# EAGLE design MEDIDOR_MTE (EAGLE 9.6.2)
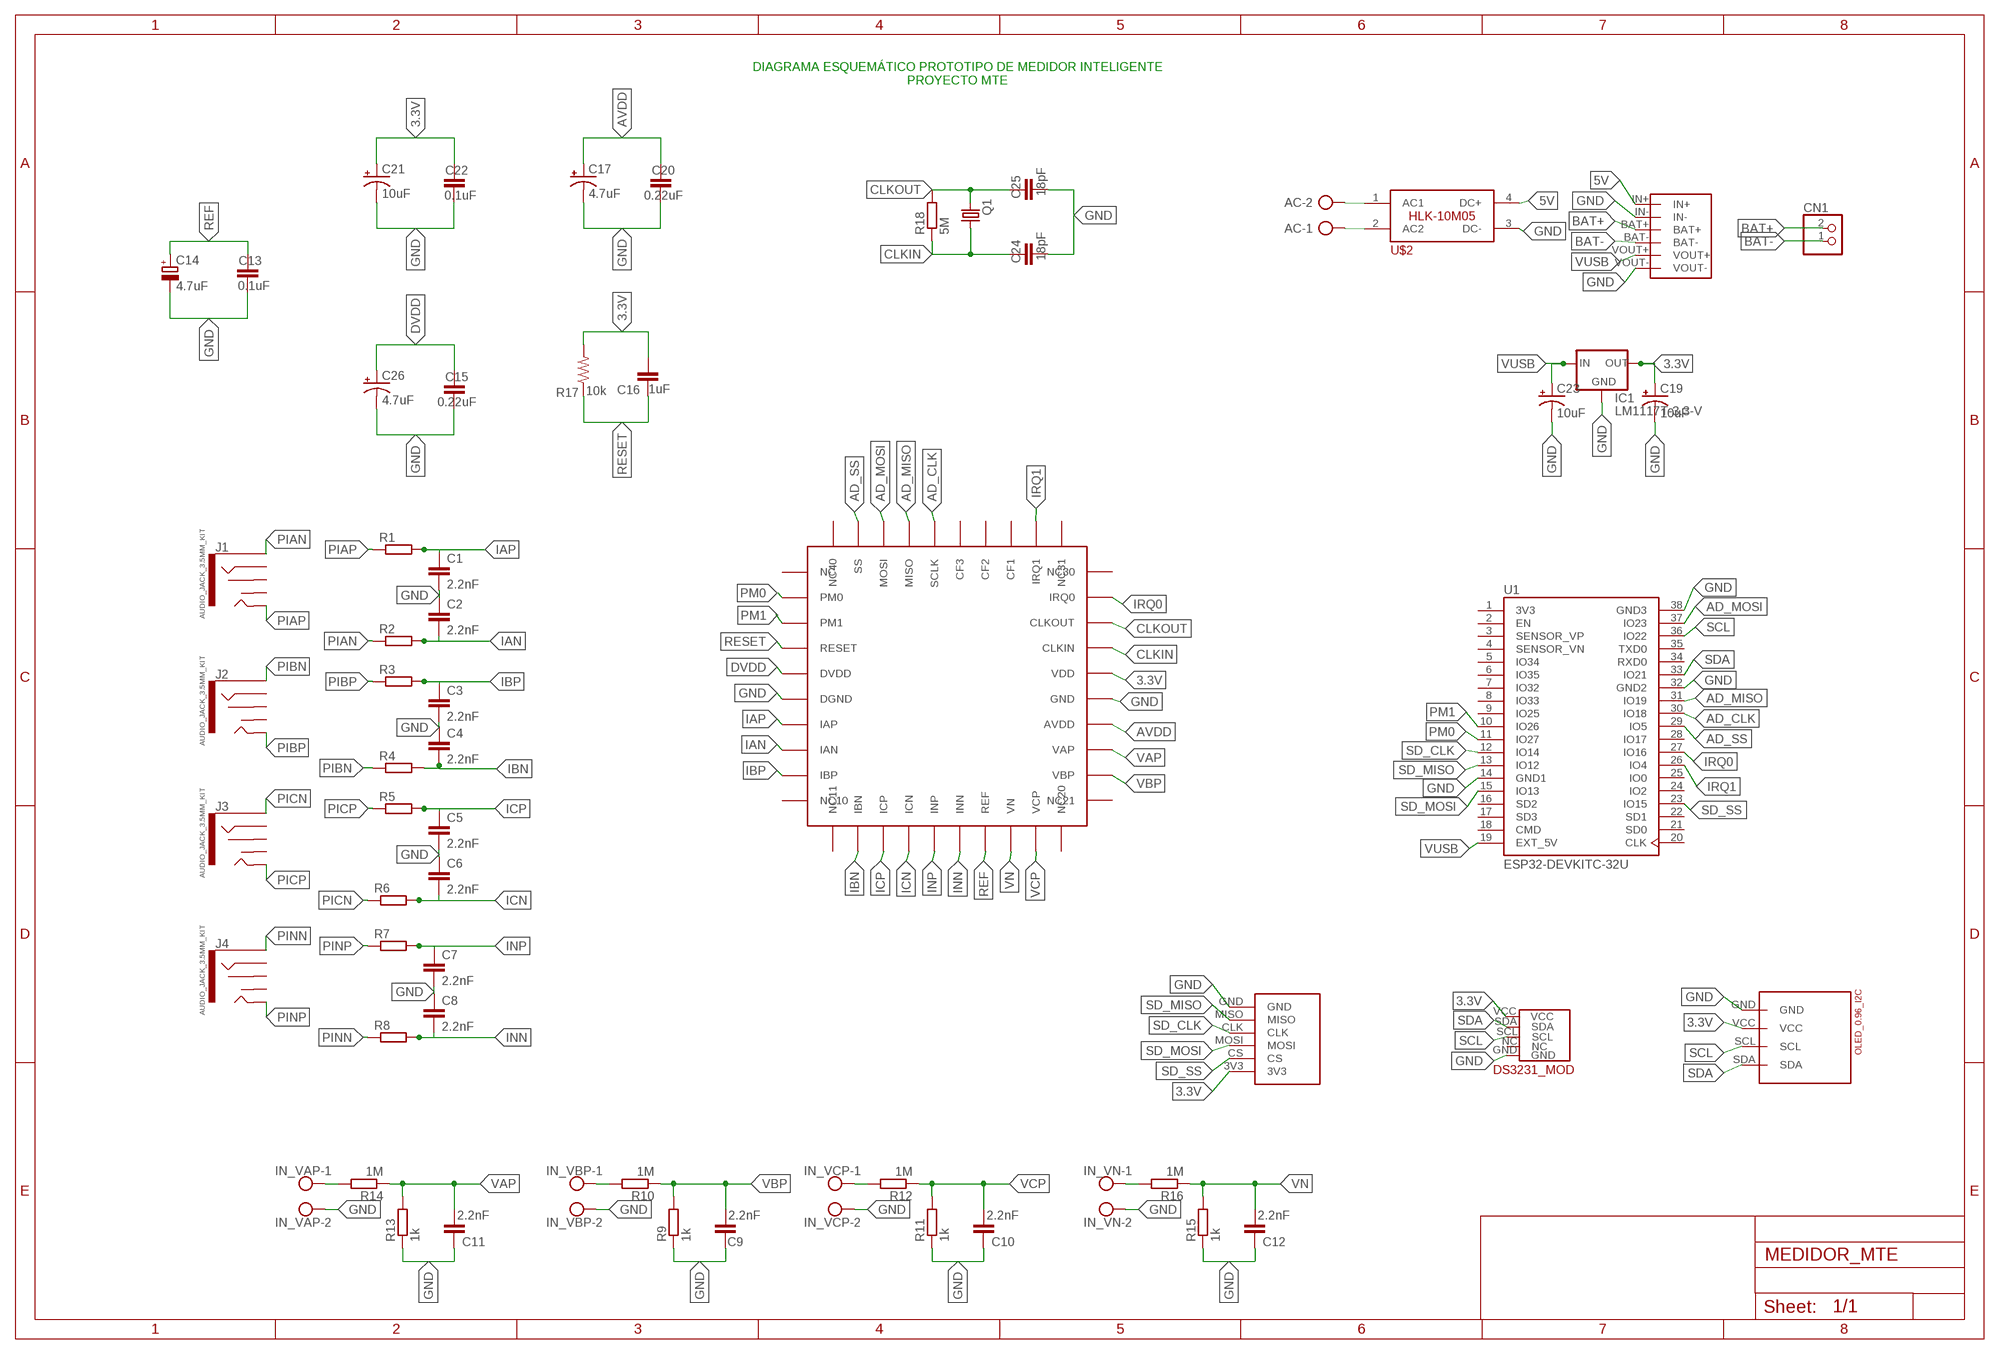
[diagram p0: schematic, sheet 1]

## Parts
AC  AK500/2  [AK500/2]
C1  2.2nF  C-EU025-025X050  [C025-025X050]
C2  2.2nF  C-EU025-025X050  [C025-025X050]
C3  2.2nF  C-EU025-025X050  [C025-025X050]
C4  2.2nF  C-EU025-025X050  [C025-025X050]
C5  2.2nF  C-EU025-025X050  [C025-025X050]
C6  2.2nF  C-EU025-025X050  [C025-025X050]
C7  2.2nF  C-EU025-025X050  [C025-025X050]
C8  2.2nF  C-EU025-025X050  [C025-025X050]
C9  2.2nF  C-EU025-025X050  [C025-025X050]
C10  2.2nF  C-EU025-025X050  [C025-025X050]
C11  2.2nF  C-EU025-025X050  [C025-025X050]
C12  2.2nF  C-EU025-025X050  [C025-025X050]
C13  0.1uF  C-EU025-025X050  [C025-025X050]
C14  4.7uF  CPOL-EUE3.5-8  [E3,5-8]
C15  0.22uF  C-EU025-025X050  [C025-025X050]
C16  1uF  C-EU025-025X050  [C025-025X050]
C17  4.7uF  CPOL-USE3.5-8  [E3,5-8]
C19  10uF  10UF-POLAR-RADIAL-2.5MM-25V-20%  [CPOL-RADIAL-2.5MM-5MM]
C20  0.22uF  C-EU025-025X050  [C025-025X050]
C21  10uF  CPOL-USE3.5-8  [E3,5-8]
C22  0.1uF  C-EU025-025X050  [C025-025X050]
C23  10uF  10UF-POLAR-RADIAL-2.5MM-25V-20%  [CPOL-RADIAL-2.5MM-5MM]
C24  18pF  C-EU025-025X050  [C025-025X050]
C25  18pF  C-EU025-025X050  [C025-025X050]
C26  4.7uF  CPOL-USE3.5-8  [E3,5-8]
CN1  JST_2PIN-THM  [JST-PH-2-THM]
IC1  LM1117T-3.3-V  [TO220V]
IN_VAP  AK500/2  [AK500/2]
IN_VBP  AK500/2  [AK500/2]
IN_VCP  AK500/2  [AK500/2]
IN_VN  AK500/2  [AK500/2]
J1  AUDIO_JACK_3.5MM_KIT  [AUDIO-JACK-KIT]
J2  AUDIO_JACK_3.5MM_KIT  [AUDIO-JACK-KIT]
J3  AUDIO_JACK_3.5MM_KIT  [AUDIO-JACK-KIT]
J4  AUDIO_JACK_3.5MM_KIT  [AUDIO-JACK-KIT]
Q1  CRYSTALHC49S  [HC49/S]
R1  R-EU_0207/12  [0207/12]
R2  R-EU_0207/12  [0207/12]
R3  R-EU_0207/12  [0207/12]
R4  R-EU_0207/12  [0207/12]
R5  R-EU_0207/12  [0207/12]
R6  R-EU_0207/12  [0207/12]
R7  R-EU_0207/12  [0207/12]
R8  R-EU_0207/12  [0207/12]
R9  1k  R-EU_0207/12  [0207/12]
R10  1M  R-EU_0207/12  [0207/12]
R11  1k  R-EU_0207/12  [0207/12]
R12  1M  R-EU_0207/12  [0207/12]
R13  1k  R-EU_0207/12  [0207/12]
R14  1M  R-EU_0207/12  [0207/12]
R15  1k  R-EU_0207/12  [0207/12]
R16  1M  R-EU_0207/12  [0207/12]
R17  10k  R-US_0207/12  [0207/12]
R18  5M  R-EU_0207/12  [0207/12]
U1  ESP32-DEVKITC-32U  [MODULE_ESP32-DEVKITC-32U]
U2  ADE7880  [ADE7880_HDER]
U$2  HLK-10M05  [HLK-10M05]
U$3  J5019_UPS  [J5019_UPS]
U$4  OLED_I2C_096  [OLED_096_I2C]
U$5  MODULO_MSD2  [MICROSD-BREAKOUT]
U$6  DS3231_MOD  [DS3231_MOD]

## Nets
3.3V: C16.2 C19.1(+) C21.+ C22.2 IC1.2(OUT) R17.2 U2.PIN26(VDD) U$4.VCC U$5.3V3 U$6.VCC
5V: U$2.4(DC+) U$3.IN+
AD_CLK: U1.30(IO18) U2.PIN36(SCLK)
AD_MISO: U1.31(IO19) U2.PIN37(MISO)
AD_MOSI: U1.37(IO23) U2.PIN38(MOSI)
AD_SS: U1.29(IO5) U2.PIN39(SS)
AVDD: C17.+ C20.2 U2.PIN24(AVDD)
BAT+: CN1.2 U$3.BAT+
BAT-: CN1.1 U$3.BAT-
CLKIN: C24.2 Q1.1 R18.1 U2.PIN27(CLKIN)
CLKOUT: C25.2 Q1.2 R18.2 U2.PIN28(CLKOUT)
DVDD: C15.2 C26.+ U2.PIN5(DVDD)
GND: C1.2 C2.1 C3.2 C4.1 C5.2 C6.1 C7.2 C8.1 C9.1 C10.1 C11.1 C12.1 C13.1 C14.- C15.1 C17.- C19.2(-) C20.1 C21.- C22.1 C23.2(-) C24.1 C25.1 C26.- IC1.1(GND) IN_VAP.2 IN_VBP.2 IN_VCP.2 IN_VN.2 R9.1 R11.1 R13.1 R15.1 U1.14(GND1) U1.32(GND2) U1.38(GND3) U2.PIN6(DGND) U2.PIN25(GND) U$2.3(DC-) U$3.IN- U$3.VOUT- U$4.GND U$5.GND U$6.GND
IAN: C2.2 R2.2 U2.PIN8(IAN)
IAP: C1.1 R1.2 U2.PIN7(IAP)
IBN: C4.2 R4.2 U2.PIN12(IBN)
IBP: C3.1 R3.2 U2.PIN9(IBP)
ICN: C6.2 R6.2 U2.PIN14(ICN)
ICP: C5.1 R5.2 U2.PIN13(ICP)
INN: C8.2 R8.2 U2.PIN16(INN)
INP: C7.1 R7.2 U2.PIN15(INP)
IRQ0: U1.27(IO16) U2.PIN29(IRQ0)
IRQ1: U1.26(IO4) U2.PIN32(IRQ1)
N$2: IN_VBP.1 R10.2
N$3: IN_VCP.1 R12.2
N$4: IN_VAP.1 R14.2
N$5: IN_VN.1 R16.2
N$6: AC.2 U$2.1(AC1)
N$7: AC.1 U$2.2(AC2)
PIAN: J1.SLEEVE R2.1
PIAP: J1.TIP R1.1
PIBN: J2.SLEEVE R4.1
PIBP: J2.TIP R3.1
PICN: J3.SLEEVE R6.1
PICP: J3.TIP R5.1
PINN: J4.SLEEVE R8.1
PINP: J4.TIP R7.1
PM0: U1.11(IO27) U2.PIN2(PM0)
PM1: U1.10(IO26) U2.PIN3(PM1)
REF: C13.2 C14.+ U2.PIN17(REF)
RESET: C16.1 R17.1 U2.PIN4(RESET)
SCL: U1.36(IO22) U$4.SCL U$6.SCL
SD_CLK: U1.12(IO14) U$5.CLK
SD_MISO: U1.13(IO12) U$5.MISO
SD_MOSI: U1.15(IO13) U$5.MOSI
SD_SS: U1.23(IO15) U$5.CS
SDA: U1.33(IO21) U$4.SDA U$6.SDA
VAP: C11.2 R13.2 R14.1 U2.PIN23(VAP)
VBP: C9.2 R9.2 R10.1 U2.PIN22(VBP)
VCP: C10.2 R11.2 R12.1 U2.PIN19(VCP)
VN: C12.2 R15.2 R16.1 U2.PIN18(VN)
VUSB: C23.1(+) IC1.3(IN) U1.19(EXT_5V) U$3.VOUT+
Unconnected: J1.RING J1.RSH J1.TSH J2.RING J2.RSH J2.TSH J3.RING J3.RSH J3.TSH J4.RING J4.RSH J4.TSH U1.2(EN) U1.3(SENSOR_VP) U1.4(SENSOR_VN) U1.5(IO34) U1.6(IO35) U1.7(IO32) U1.8(IO33) U1.9(IO25) U1.16(SD2) U1.17(SD3) U1.18(CMD) U1.20(CLK) U1.21(SD0) U1.22(SD1) U1.24(IO2) U1.25(IO0) U1.28(IO17) U1.34(RXD0) U1.35(TXD0) U2.PIN1(NC) U2.PIN10(NC10) U2.PIN11(NC11) U2.PIN20(NC20) U2.PIN21(NC21) U2.PIN30(NC30) U2.PIN31(NC31) U2.PIN33(CF1) U2.PIN34(CF2) U2.PIN35(CF3) U2.PIN40(NC40) U$6.NC

## Notes on the sheet
- DIAGRAMA ESQUEMÁTICO PROTOTIPO DE MEDIDOR INTELIGENTE
  PROYECTO MTE

## Power pins joined to a net without a drawn wire
3V3: U1.1(3V3)

## Library data of the parts
AC IN_VAP IN_VBP IN_VCP IN_VN = con-ptr500_v2:AK500/2: CONNECTOR; OC_FARNELL: unknown; OC_NEWARK: unknown
C1-C13 C15 C16 C20 C22 C24 C25 = rcl:C-EU: CAPACITOR, European symbol; SPICEPREFIX: C
C14 = rcl:CPOL-EU: POLARIZED CAPACITOR, European symbol; SPICEPREFIX: C
C17 C21 C26 = rcl:CPOL-US: POLARIZED CAPACITOR, American symbol; SPICEPREFIX: C
C19 C23 = SparkFun-Capacitors:10UF-POLAR: 10.0µF polarized capacitors A capacitor is a passive two-terminal electrical component used to store electrical energy temporarily in an electric field.; PROD_ID: CAP-08440
CN1 = adafruit:JST_2PIN: JST 2-Pin Connectors of various flavors SMT-RA (S2B-PH-SM4) 4UConnector #17311 SMT (B2B-PH-SM4) THM-RA (S2B-PH) THM (B2B-PH)
IC1 = lm1117:LM1117T-*
J1-J4 = SparkFun-Connectors:AUDIO_JACK_3.5MM: Audio Jack 3.5mm variants of PTH and SMT stereo audio jack with bypass switches. SparkFun Products: SparkFun SparkPunk Sound Kit <[https://www.sparkfun.com/products/11177]> - PTH MP3 Trigger <https://www.sparkfun.com/products/13720> -3.5mm SMD SparkFun PicoBoard <https://www.sparkfun.com/products/11888>- 2.5mm SMD; PROD_ID: CONN-08774; SF_ID: PRT-08032
Q1 = crystal_v2:CRYSTAL: CRYSTAL; OC_FARNELL: 1667008; OC_NEWARK: unknown
R1-R8 = rcl:R-EU_: RESISTOR, European symbol; SPICEPREFIX: R
R9-R16 R18 = rcl_v2:R-EU_: RESISTOR, European symbol; SPICEPREFIX: R
R17 = rcl:R-US_: RESISTOR, American symbol; SPICEPREFIX: R
U1 = ESP32-DEVKITC-32U:ESP32-DEVKITC-32U: ESP32-DEVKITC Check availability <https://pricing.snapeda.com/parts/ESP32-DEVKITC-32U/Espressif%20Systems/view-part?ref=eda>; AVAILABILITY: In Stock; CHECK_PRICES: https://www.snapeda.com/parts/ESP32-DEVKITC-32U/Espressif+Systems/view-part/?ref=eda; DESCRIPTION: ESP32-WROOM-32UE series Transceiver; 802.11 b/g/n (Wi-Fi, WiFi, WLAN), Bluetooth® Smart Ready 4.x Dual Mode Evaluation Board; MF: Espressif Systems; MP: ESP32-DEVKITC-32U; PACKAGE: CUSTOM-38 ESPRESSIF; PRICE: None; PURCHASE-URL: https://www.snapeda.com/api/url_track_click_mouser/?unipart_id=2781909&manufacturer=Espressif Systems&part_name=ESP32-DEVKITC-32U&search_term=None; SNAPEDA_LINK: https://www.snapeda.com/parts/ESP32-DEVKITC-32U/Espressif+Systems/view-part/?ref=snap
U2 = ADE7881_HDER:ADE7880
U$2 = HLK-10M05_V2:HLK-10M05; AVAILABILITY: Unavailable; MF: Hi-link; MP: hlk-pm01; PACKAGE: Package Analog Devices; PRICE: None
U$3 = POWER_SOURCES:J5019_UPS
U$4 = OLED_I2C:OLED_I2C_096
U$5 = MSD2:MODULO_MSD2
U$6 = DS3231_,MOD:DS3231_MOD

## Board
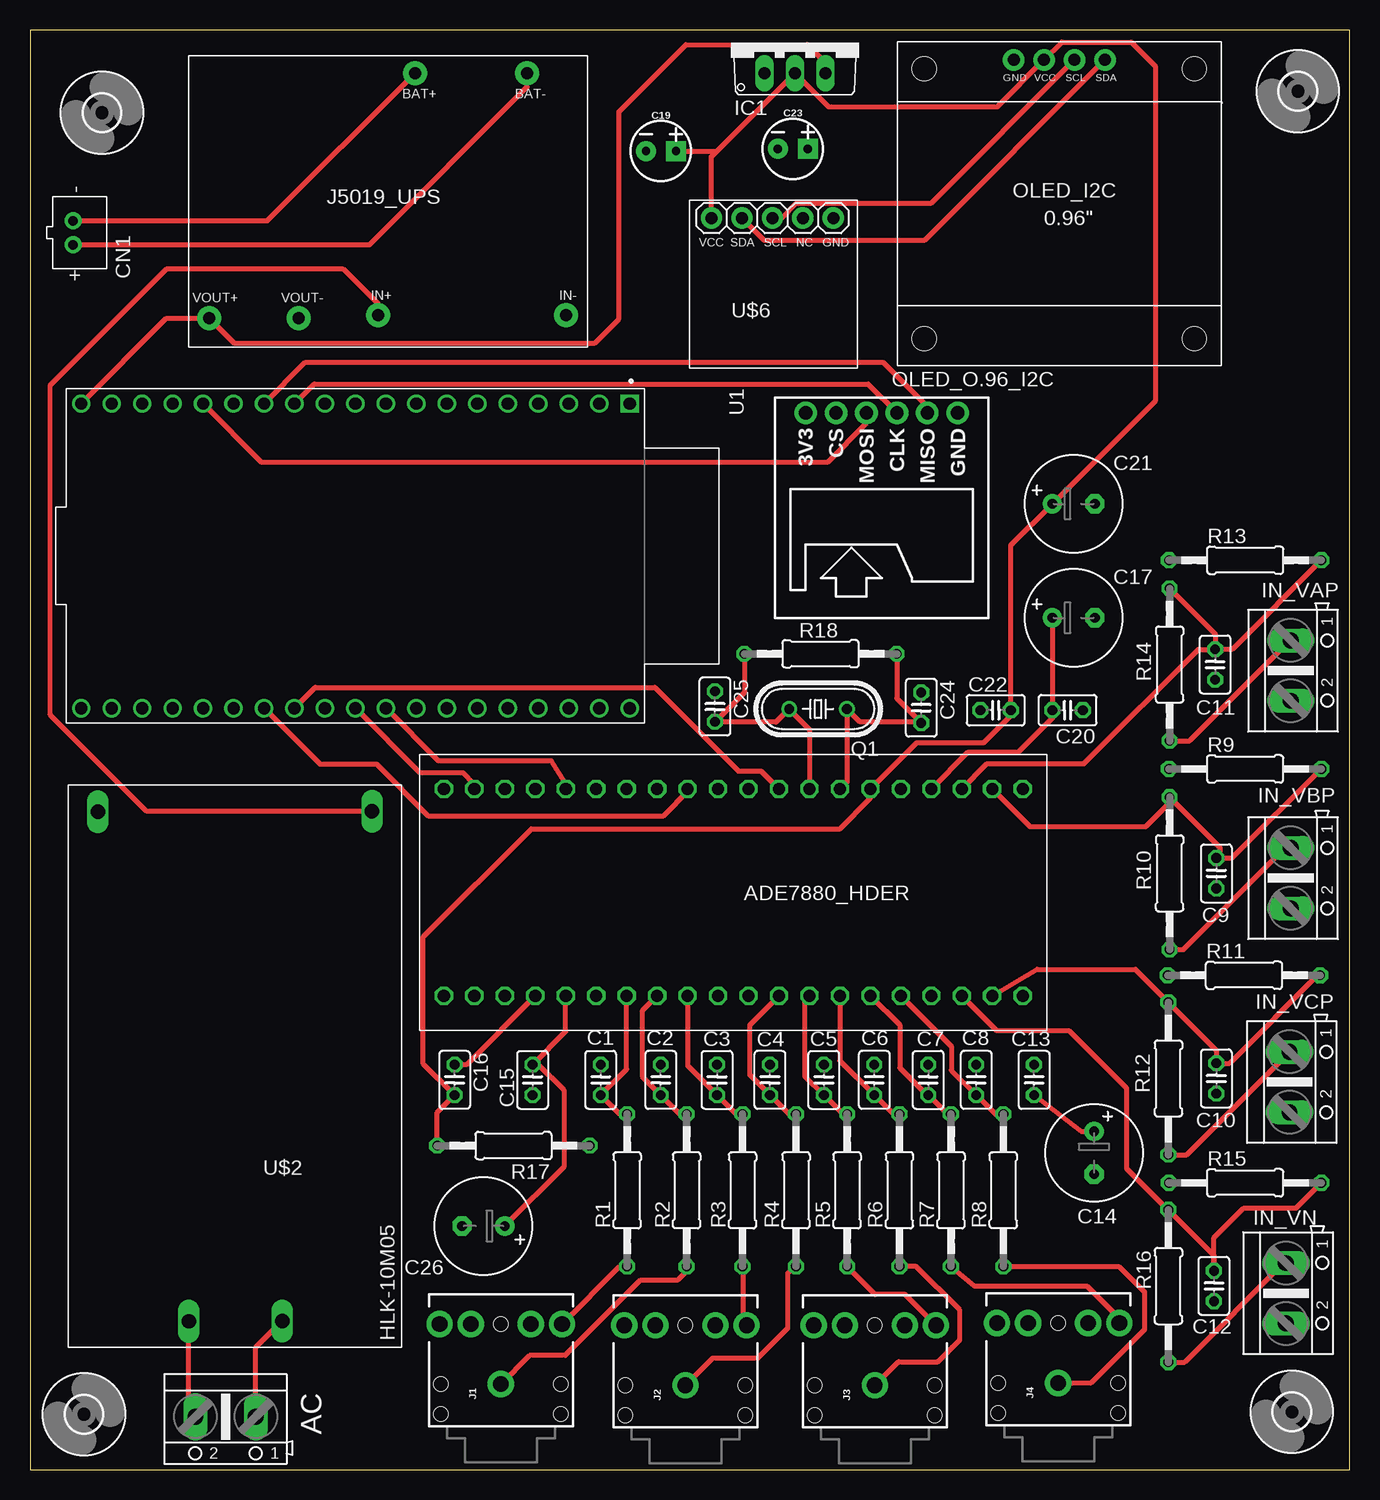
[diagram p1: board, top side]
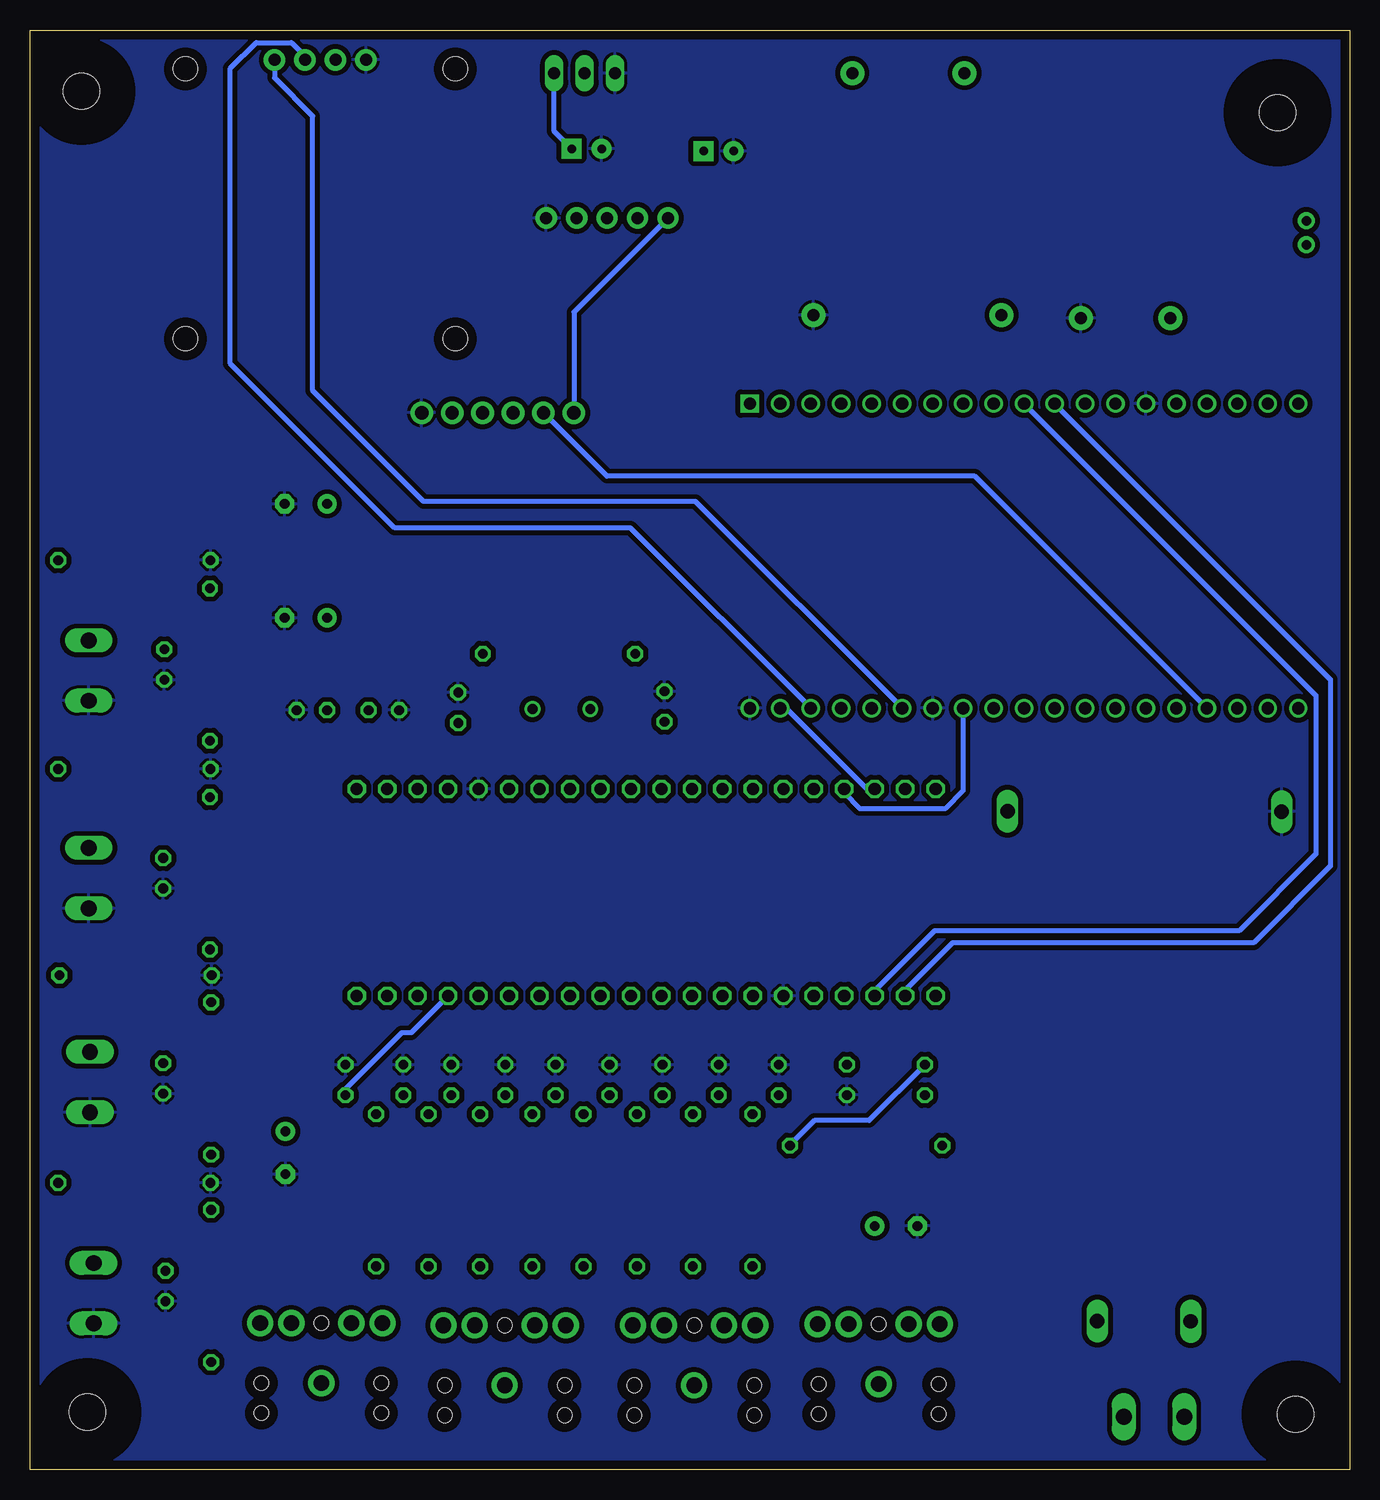
[diagram p2: board, bottom side, seen from below]

Size 110 x 120 mm. Coordinates in mm from the lower left corner, seen from the top.
Outline: 0,0 110,0 110,120 0,120 0,0
Copper layers (1*16): Top 0.035mm / dielectric 1.5mm / Bottom 0.035mm
Design rules "default *": minimum track width 6mil, minimum drill 0.35mm, track to track 6mil, track to pad 6mil, pad to pad 6mil, via to via 6mil, smd to smd 6mil, copper to edge 30mil, drill to drill 6mil, minimum pad ring 10mil, minimum via ring 8mil, stop-mask expansion 4mil, vias tented up to drill 0mil, thermal gap 10mil

### Footprints (pad centres in the part's own frame; a part is rotated, then mirrored left to right if it is on the bottom)
AK500/2 = drill 1.321 long: 1 -2.515,0; 2 2.515,0
C025-025X050 = drill 0.813 octagon: 1 -1.27,0; 2 1.27,0
E3,5-8 = drill 0.813 pad 1.6: + -1.778,0 | drill 0.813 pad 1.6 octagon: - 1.778,0
CPOL-RADIAL-2.5MM-5MM = drill 0.7 pad 1.651 square: 1 1.25,0 | drill 0.7 pad 1.651: 2 -1.25,0
JST-PH-2-THM = drill 0.8 pad 1.422: 1 1,0; 2 -1,0
TO220V = drill 1.016 long: 1 -2.54,-2.54; 2 0,-2.54; 3 2.54,-2.54
AUDIO-JACK-KIT = drill 1.3 pad 2.184: RING 5,5.1; RSH 5,2.5; SLEEVE 0,0; TIP 5,-5.1; TSH 5,-2.5 | hole 1.2: 0,5; -2.5,5; -2.5,-5; 0,-5; 5,0
HC49/S = drill 0.813: 1 -2.413,0; 2 2.413,0
0207/12 = drill 0.813 octagon: 1 -6.35,0; 2 6.35,0
MODULE_ESP32-DEVKITC-32U = drill 1.02 square: 1 -12.7,22.85 | drill 1.02: 2 -12.7,20.31; 3 -12.7,17.77; 4 -12.7,15.23; 5 -12.7,12.69; 6 -12.7,10.15; 7 -12.7,7.61; 8 -12.7,5.07; 9 -12.7,2.53; 10 -12.7,-0.01; 11 -12.7,-2.55; 12 -12.7,-5.09; 13 -12.7,-7.63; 14 -12.7,-10.17; 15 -12.7,-12.71; 16 -12.7,-15.25; 17 -12.7,-17.79; 18 -12.7,-20.33; 19 -12.7,-22.87; 20 12.7,-22.87; 21 12.7,-20.33; 22 12.7,-17.79; 23 12.7,-15.25; 24 12.7,-12.71; 25 12.7,-10.17; 26 12.7,-7.63; 27 12.7,-5.09; 28 12.7,-2.55; 29 12.7,-0.01; 30 12.7,2.53; 31 12.7,5.07; 32 12.7,7.61; 33 12.7,10.15; 34 12.7,12.69; 35 12.7,15.23; 36 12.7,17.77; 37 12.7,20.31; 38 12.7,22.85
ADE7880_HDER = drill 1.016 octagon: PIN1 -8.624,24.13; PIN2 -8.624,21.59; PIN3 -8.624,19.05; PIN4 -8.624,16.51; PIN5 -8.624,13.97; PIN6 -8.624,11.43; PIN7 -8.624,8.89; PIN8 -8.624,6.35; PIN9 -8.624,3.81; PIN10 -8.624,1.27; PIN11 -8.624,-1.27; PIN12 -8.624,-3.81; PIN13 -8.624,-6.35; PIN14 -8.624,-8.89; PIN15 -8.624,-11.43; PIN16 -8.624,-13.97; PIN17 -8.624,-16.51; PIN18 -8.624,-19.05; PIN19 -8.624,-21.59; PIN20 -8.624,-24.13; PIN21 8.624,-24.13; PIN22 8.624,-21.59; PIN23 8.624,-19.05; PIN24 8.624,-16.51; PIN25 8.624,-13.97; PIN26 8.624,-11.43; PIN27 8.624,-8.89; PIN28 8.624,-6.35; PIN29 8.624,-3.81; PIN30 8.624,-1.27; PIN31 8.624,1.27; PIN32 8.624,3.81; PIN33 8.624,6.35; PIN34 8.624,8.89; PIN35 8.624,11.43; PIN36 8.624,13.97; PIN37 8.624,16.51; PIN38 8.624,19.05; PIN39 8.624,21.59; PIN40 8.624,24.13
HLK-10M05 = drill 1.2 long: 1 -14.827,7.745; 2 -14.789,-0.049; 3 27.667,15.32; 4 27.679,-7.535
J5019_UPS = drill 1 pad 2: BAT+ 18.855,22.829; BAT- 28.22,22.829; IN+ 15.777,2.666; IN- 31.454,2.666; VOUT+ 1.718,2.385; VOUT- 9.169,2.385
OLED_096_I2C = drill 1 pad 1.778: GND -3.8,12; SCL 1.28,12; SDA 3.82,12; VCC -1.26,12 | hole 2: -11.25,11.25; -11.25,-11.25; 11.25,-11.25; 11.25,11.25
MICROSD-BREAKOUT = drill 1.118 pad 1.88: 3V3 -5.89,8.7; CLK 1.73,8.7; CS -3.35,8.7; GND 6.81,8.7; MISO 4.27,8.7; MOSI -0.81,8.7
DS3231_MOD = drill 1 pad 1.778: GND 5.01,5.51; NC 2.47,5.51; SCL -0.07,5.51; SDA -2.61,5.51; VCC -5.15,5.51
3,0 = hole 3: 0,0

### Placement (x,y rotation side)
AC  16.3,4.4 180 top
C1  47.58,32.48 90 top
C2  52.58,32.48 270 top
C3  57.28,32.48 90 top
C4  61.68,32.48 270 top
C5  66.18,32.48 90 top
C6  70.38,32.48 270 top
C7  74.88,32.48 90 top
C8  78.88,32.48 270 top
C9  98.9,49.7 90 top
C10  98.9,32.6 90 top
C11  98.8,67.1 90 top
C12  98.7,15.3 90 top
C13  83.7,32.48 270 top
C14  88.7,26.4 270 top
C15  41.9,32.48 90 top
C16  35.4,32.48 270 top
C17  87,71 0 top
C19  52.6,109.9 0 top
C20  86.5,63.3 180 top
C21  87,80.5 0 top
C22  80.5,63.3 0 top
C23  63.6,110.1 0 top
C24  74.3,63.5 270 top
C25  57.1,63.6 270 top
C26  37.8,20.3 180 top
CN1  3.6,103.1 270 top
IC1  63.77,118.94 0 top
IN_VAP  105.1,66.6 270 top
IN_VBP  105.1,49.3 270 top
IN_VCP  105,32.3 270 top
IN_VN  104.7,14.7 270 top
J1  39.25,7.12 90 top
J2  54.64,7.02 90 top
J3  70.43,7.02 90 top
J4  85.71,7.2 90 top
Q1  65.7,63.4 180 top
R1  49.78,23.28 90 top
R2  54.74,23.28 90 top
R3  59.4,23.28 90 top
R4  63.86,23.28 90 top
R5  68.12,23.28 90 top
R6  72.48,23.28 90 top
R7  76.78,23.28 90 top
R8  81.14,23.28 90 top
R9  101.3,58.4 0 top
R10  95,49.7 270 top
R11  101.2,41.2 0 top
R12  94.9,32.6 270 top
R13  101.3,75.8 0 top
R14  95,67.1 270 top
R15  101.3,23.9 0 top
R16  94.9,15.3 270 top
R17  40.3,27 180 top
R18  65.9,68 180 top
U1  27.14,76.16 270 top
U2  58.63,48.11 90 top
U$2  20.98,27.18 90 top
U$3  13.23,93.58 0 top
U$4  85.8,105.51 0 top
U$5  70.54,79.39 0 top
U$6  61.96,98.82 0 top
U$7  [3,0]  105.2,4.8 0 top
U$8  [3,0]  4.5,4.6 0 top
U$9  [3,0]  105.7,114.9 0 top
U$10  [3,0]  6,113.1 0 top

### Tracks (layer width: path | path; a pad name or v marks a point on that pad's centre or on a via)
3.3V
  Top 0.406: U$6.VCC 56.81,109.44 57.27,109.9 | R17.2 33.95,29.76 C16.2 32.78,33.83 32.78,44.38 41.8,53.4 67.5,53.4 70.06,55.96 U2.PIN26 73.93,60.6 79.5,60.6 81.77,62.87 C22.2 81.77,77.05 C21.+ 93.8,89.08 93.8,116.98 91.8,118.98 86.01,118.98 U$4.VCC 80.63,113.6 66.57,113.6 IC1.2 57.53,110.17 57.27,109.9 | C19.1 57.27,109.9
  Bottom 0.406: U$6.VCC 64.65,96.49 U$5.3V3
5V
  Top 0.406: U$2.4 9.74,54.86 1.7,62.9 1.7,90.4 11.4,100.1 26.1,100.1 29.01,97.19 U$3.IN+
AD_CLK
  Top 0.406: U1.30 34.03,59.1 43.45,59.1 44.66,57.2 U2.PIN36
AD_MISO
  Bottom 0.406: U1.31 32.21,56.59 33.7,55.1 40.84,55.1 42.12,56.38 U2.PIN37
AD_MOSI
  Bottom 0.406: U1.37 46.96,63.46 40.23,56.73 U2.PIN38
AD_SS
  Top 0.406: U1.29 32.49,58.1 36.1,58.1 37.04,57.16 U2.PIN39
AVDD
  Top 0.406: C17.+ C20.2 85.23,62.63 82.4,59.8 78.21,59.8 U2.PIN24
BAT+
  Top 0.406: CN1.2 19.78,104.1 U$3.BAT+
BAT-
  Top 0.406: CN1.1 28.3,102.1 41.45,115.25 U$3.BAT-
CLKIN
  Top 0.406: U2.PIN27 68.11,57.33 Q1.1 69.15,62.37 74.44,62.37 C24.2 72.25,64.28 R18.1
CLKOUT
  Top 0.406: U2.PIN28 64.98,61.71 Q1.2 62.19,62.3 57.13,62.3 C25.2 59.55,64.78 R18.2
DVDD
  Top 0.406: C26.+ 44.52,25.24 44.52,31.63 42.4,33.75 C15.2 44.66,36.51 U2.PIN5
GND
  pour Bottom (isolate 0.406): 0,0 0,120 110,120 110,0
IAN
  Top 0.406: U2.PIN8 51.06,38.27 51.06,32.73 C2.2 54.16,29.63 R2.2
IAP
  Top 0.406: R1.2 49.16,29.63 C1.1 49.74,33.37 U2.PIN7
IBN
  Top 0.406: U2.PIN12 60,37.05 60,32.89 C4.2 63.26,29.63 R4.2
IBP
  Top 0.406: U2.PIN9 54.82,33.67 C3.1 58.86,29.63 R3.2
ICN
  Top 0.406: U2.PIN14 67.52,34.07 C6.2 71.96,29.63 R6.2
ICP
  Top 0.406: U2.PIN13 64.58,39.09 64.58,32.81 C5.1 67.76,29.63 R5.2
INN
  Top 0.406: U2.PIN16 76.8,35.29 76.8,33.29 C8.2 80.46,29.63 R8.2
INP
  Top 0.406: U2.PIN15 72.5,37.05 72.5,33.5 74.79,31.21 C7.1 76.46,29.63 R7.2
IRQ0
  Top 0.406: U1.27 23.79,65.2 52.1,65.2 59.1,58.2 60.97,58.2 U2.PIN29
IRQ1
  Top 0.406: U1.26 24.17,58.8 28.9,58.8 33.2,54.5 52.8,54.5 54.94,56.64 U2.PIN32
N$2
  Top 0.406: R10.2 96.16,43.35 104.62,51.81 IN_VBP.1
N$3
  Top 0.406: R12.2 96.44,26.25 IN_VCP.1
N$4
  Top 0.406: R14.2 96.66,60.75 105.02,69.11 IN_VAP.1
N$5
  Top 0.406: IN_VN.1 104.52,17.21 96.26,8.95 R16.2
N$6
  Top 0.406: AC.2 13.23,4.95 U$2.1
N$7
  Top 0.406: AC.1 18.82,10.18 U$2.2
PIAN
  Top 0.406: J1.SLEEVE 41.65,9.52 44.62,9.52 50.9,15.8 54,15.8 54.74,16.54 R2.1
PIAP
  Top 0.406: J1.TIP 49.16,16.93 R1.1
PIBN
  Top 0.406: J2.SLEEVE 56.92,9.3 60.7,9.3 63.16,11.76 63.16,16.37 63.49,16.56 R4.1
PIBP
  Top 0.406: J2.TIP 59.44,12.32 59.44,16.94 R3.1
PICN
  Top 0.406: J3.SLEEVE 72.41,9 75.7,9 77.5,10.8 77.5,13.3 73.87,16.93 R6.1
PICP
  Top 0.406: J3.TIP 72.95,14.6 70.45,14.6 R5.1
PINN
  Top 0.406: J4.SLEEVE 88.44,7.2 92.9,11.66 92.9,14.8 90.77,16.93 R8.1
PINP
  Top 0.406: R7.1 78.73,15.3 88.1,15.3 90.81,12.59 J4.TIP
PM0
  Bottom 0.406: U1.11 1.6,65.87 1.6,50.3 8,43.9 33.1,43.9 37.04,39.96 U2.PIN2
PM1
  Bottom 0.406: U1.10 2.8,64.53 2.8,51.3 9.2,44.9 34.6,44.9 39.58,39.92 U2.PIN3
REF
  Top 0.406: C13.2 87.65,28.18 C14.+
  Bottom 0.406: U2.PIN17 78.23,36.4 79.01,36.4 83.7,31.71 C13.2
RESET
  Top 0.406: U2.PIN4 36.38,33.75 C16.1
  Bottom 0.406: C16.1 40.05,29.1 44.6,29.1 46.65,27.05 R17.1
SCL
  Top 0.406: U$6.SCL 62.67,104.33 63.91,105.58 75.14,105.58 U$4.SCL
  Bottom 0.406: U1.36 59.95,78.5 79.6,78.5 93.3,92.2 93.3,116.8 91.14,118.95 88.2,118.95 87.08,117.83 U$4.SCL
SD_CLK
  Top 0.406: U1.12 23.69,90.5 69.86,90.5 U$5.CLK
SD_MISO
  Top 0.406: U1.13 22.95,92.3 71.1,92.3 74.81,88.59 U$5.MISO
SD_MOSI
  Top 0.406: U1.15 19.29,84 66.5,84 69.73,87.23 U$5.MOSI
SD_SS
  Bottom 0.406: U1.23 31.23,82.8 61.9,82.8 U$5.CS
SDA
  Top 0.406: U$6.SDA 59.35,104.31 61.17,102.48 74.59,102.48 U$4.SDA
  Bottom 0.406: U1.33 54.53,80.7 77.2,80.7 86.44,89.94 86.44,112.83 89.62,116.01 U$4.SDA
VAP
  Top 0.406: R14.1 98.8,69.65 C11.2 | R13.2 100.22,68.37 C11.2 | C11.2 97.4,68.37 87.86,58.84 79.78,58.84 U2.PIN23
VBP
  Top 0.406: C9.2 99.2,50.97 | 99.2,50.97 100.2,50.97 107.63,58.4 R9.2 | R10.1 95.22,55.83 | 95.22,55.83 99.2,51.85 99.2,50.97 | 95.22,55.83 93,53.6 84.4,53.6 84.1,53.6 83.35,53.6 U2.PIN22
VCP
  Top 0.406: U2.PIN19 83.94,41.7 92.15,41.7 R12.1 98.9,34.95 C10.2 100,33.87 107.33,41.2 R11.2
VN
  Top 0.406: R15.2 105.55,21.8 101.2,21.8 98.7,19.3 C12.2 98.7,17.85 R16.1 94.85,21.65 91.4,25.1 91.4,31.8 86.6,36.6 80.57,36.6 U2.PIN18
VUSB
  Top 0.406: U1.19 11.38,95.97 U$3.VOUT+ 17.01,93.9 47.1,93.9 49.1,95.9 49.1,113.2 54.68,118.78 64.8,118.78 66.31,117.27 IC1.3
  Bottom 0.406: C23.1 66.31,111.56 IC1.3